# Altium schematic sheet Scratch.SchDoc: =TITLE
size A3
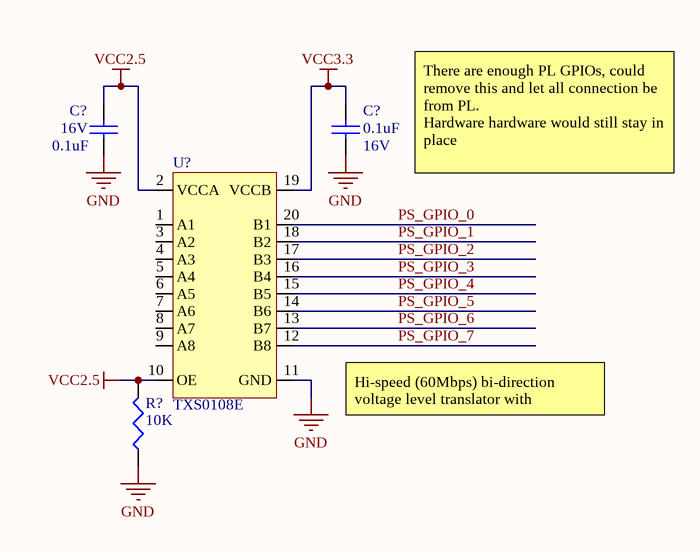
[diagram p0: Scratch.SchDoc]

## Parts
(Parts that share a designator on the sheet are numbered #1, #2 ... from top to bottom, then left to right.)
C?#1  value 0.1uF  Rating: 16V  [C0402]  (hidden comment: 04026D226MAT2A)
C?#2  value 0.1uF  Rating: 16V  [C0402]  (hidden comment: 04026D226MAT2A)
R?  value 10K  [R0402]  (hidden comment: ?)
U?  TXS0108E  [PBGA20]

## Nets
GND: C?#1.2 C?#2.1 R?.1 U?.11(GND)
VCC2.5: C?#2.2 R?.2 U?.2(VCCA) U?.10(OE)
VCC3.3: C?#1.1 U?.19(VCCB)
PS_GPIO_0: U?.20(B1)
PS_GPIO_1: U?.18(B2)
PS_GPIO_2: U?.17(B3)
PS_GPIO_3: U?.16(B4)
PS_GPIO_4: U?.15(B5)
PS_GPIO_5: U?.14(B6)
PS_GPIO_6: U?.13(B7)
PS_GPIO_7: U?.12(B8)

Not connected (* = marked no-connect by the designer): U? 1(A1) 3(A2) 4(A3) 5(A4) 6(A5) 7(A6) 8(A7) 9(A8)

## Notes on the sheet
- There are enough PL GPIOs, could remove this and let all connection be from PL.
  Hardware hardware would still stay in place
- Hi-speed (60Mbps) bi-direction voltage level translator with auto-detection
- Description
- Title
- Size:
- Date:
- A3
- Number:
- Time:
- Revision:
- Sheet
- of
- File:
- Author:

## Library data of the parts
C?#1 C?#2 = Cap: Capacitor; PackageDescription: Chip Capacitor
R? = Res: Resistor; Tolerance: 5%; PackageDescription: Chip Resistor
U? = TXS0108E: TXS0108E 8-Bit Bi-directional, Level-Shifting, Voltage Translator for Open-Drain and Push-Pull Applications; pin to pad: 1>B1 2>A1 3>A2 4>B2 5>A3 6>B3 7>A4 8>B4 9>A5 10>B5 11>C5 12>D5 13>C4 14>D4 15>C3 16>D3 17>B3 18>D2 19>D1 20>C1